# EasyEDA schematic SCH_Sensor IR - Trilho Ferrorama_2023-09-23 (1).json

## Sheets
1 Sheet_1: TITLE: Sheet_1; REV: 1.0; Date: 2023-09-11; Sheet: 1/1; Drawn By: thalesalves1; Company: Your Company
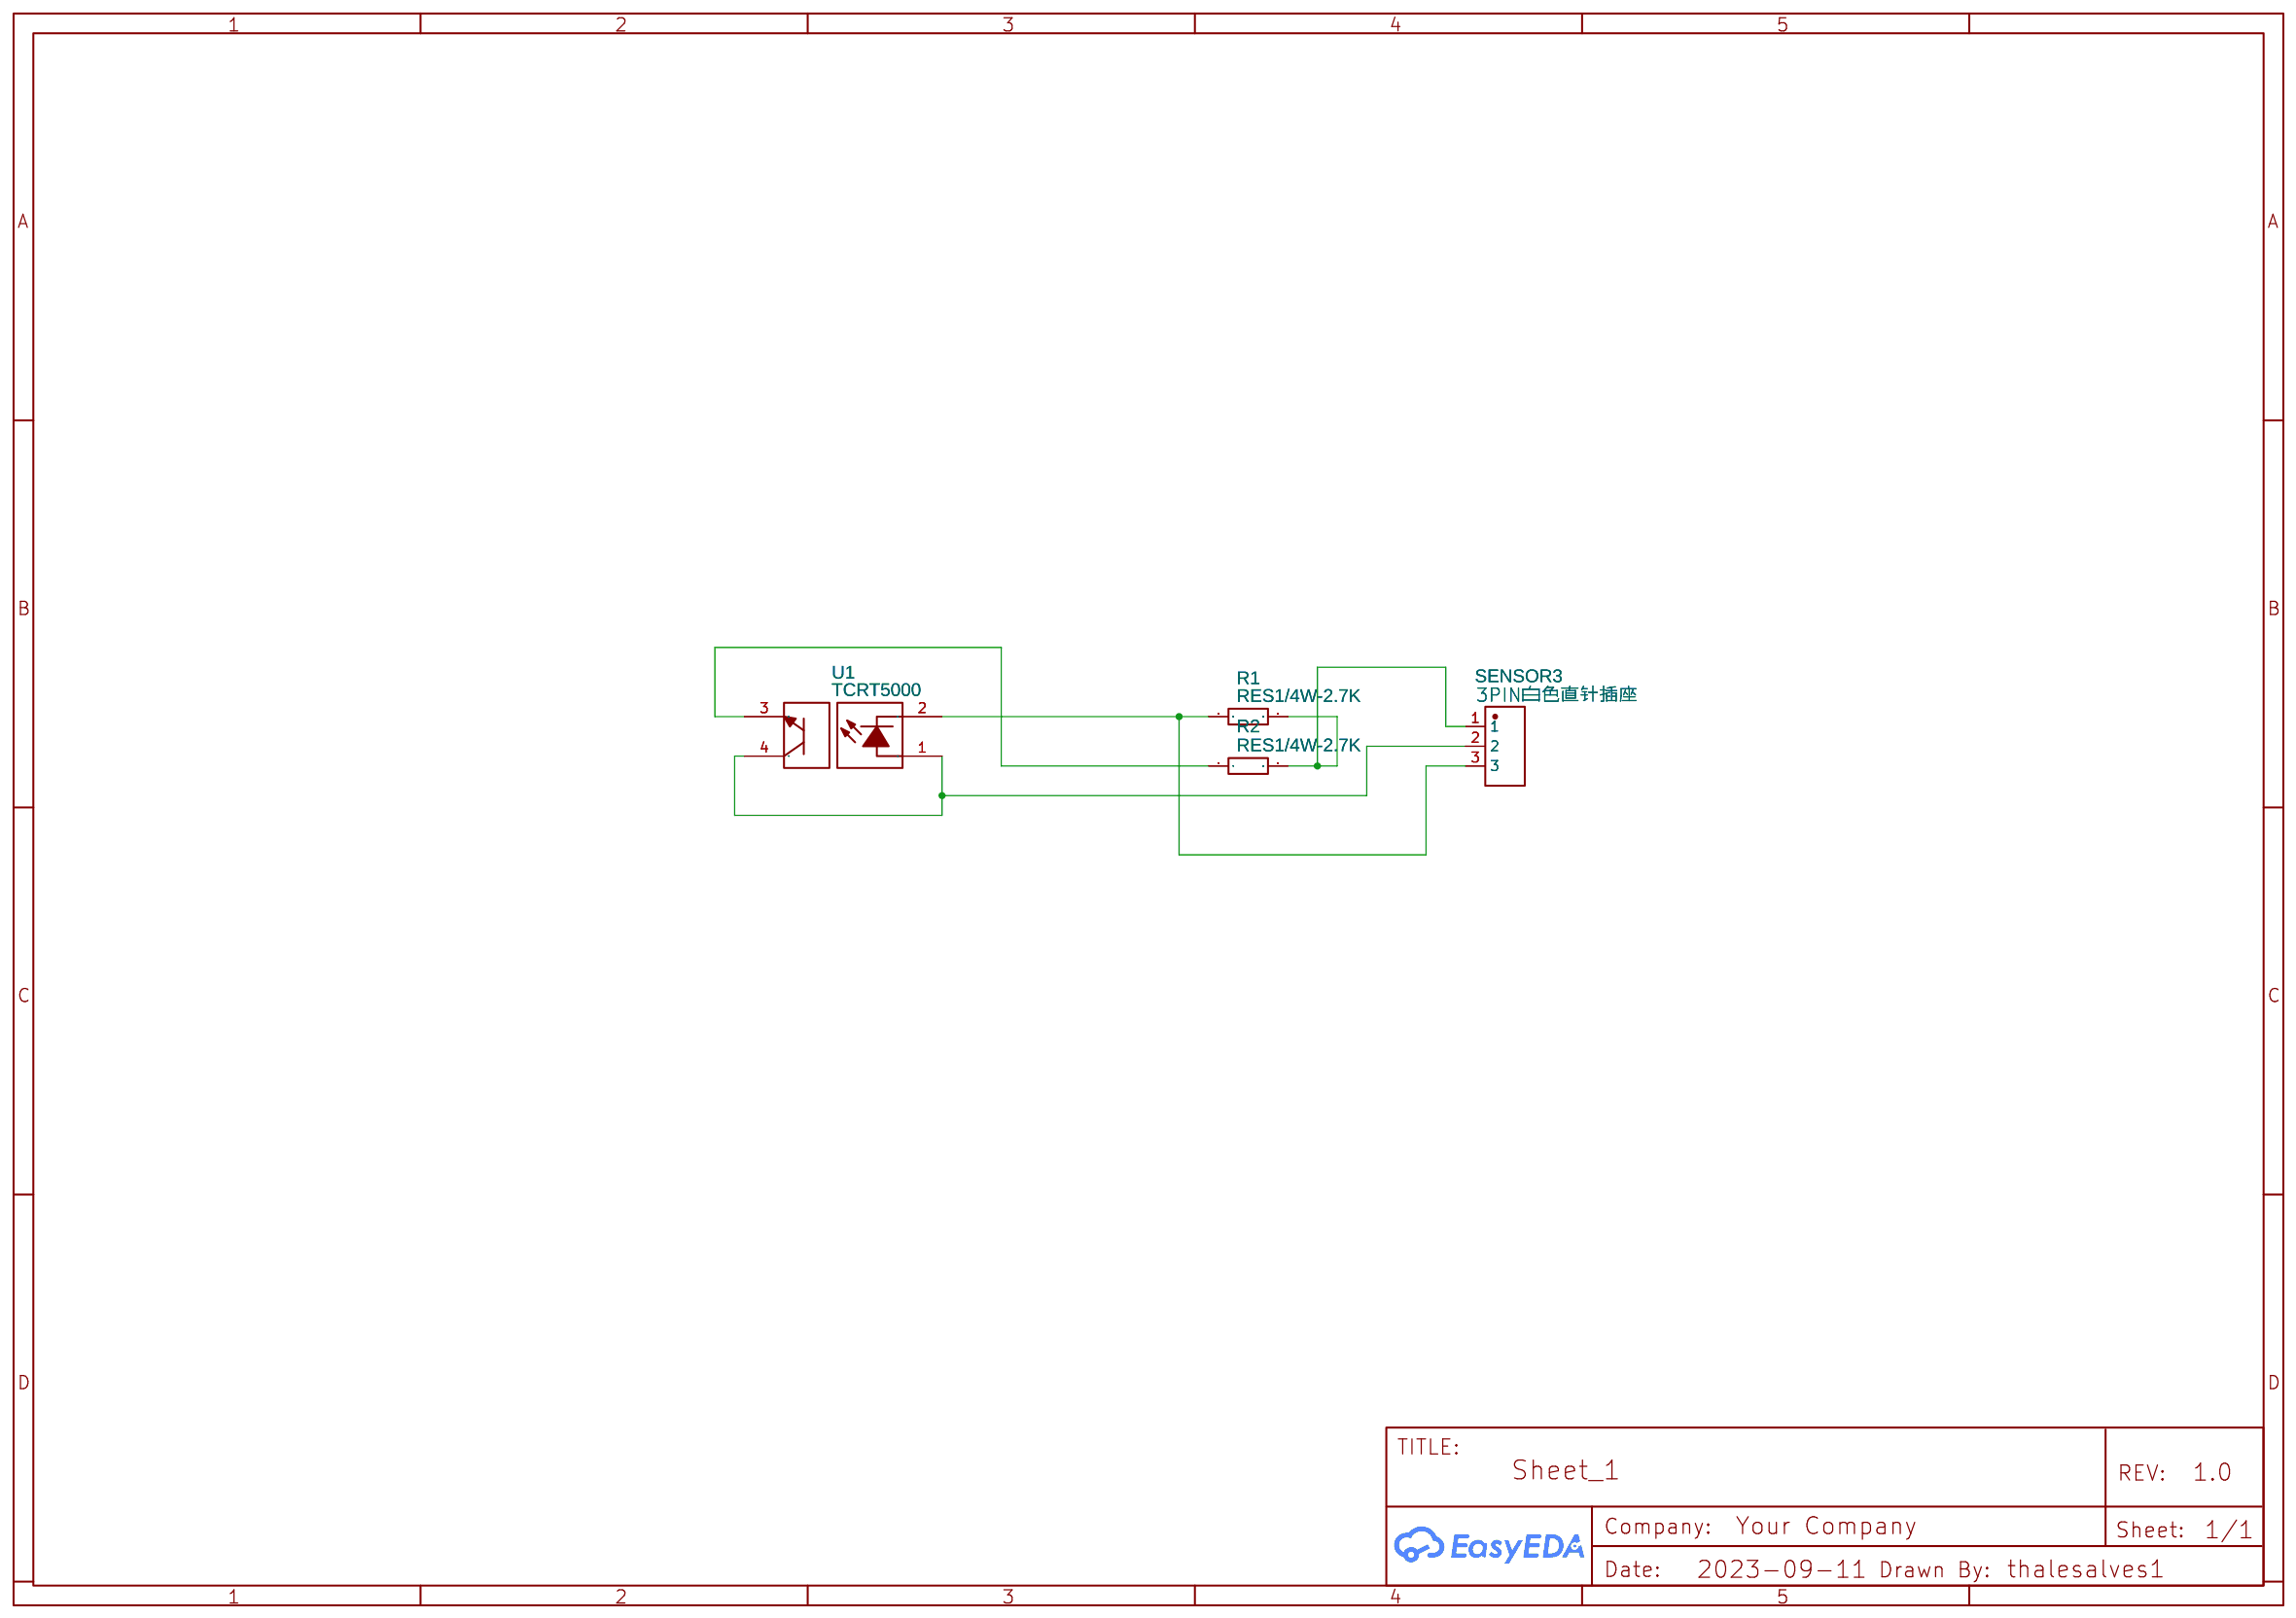
[diagram p0: Sheet_1]
2 Sheet_1#2
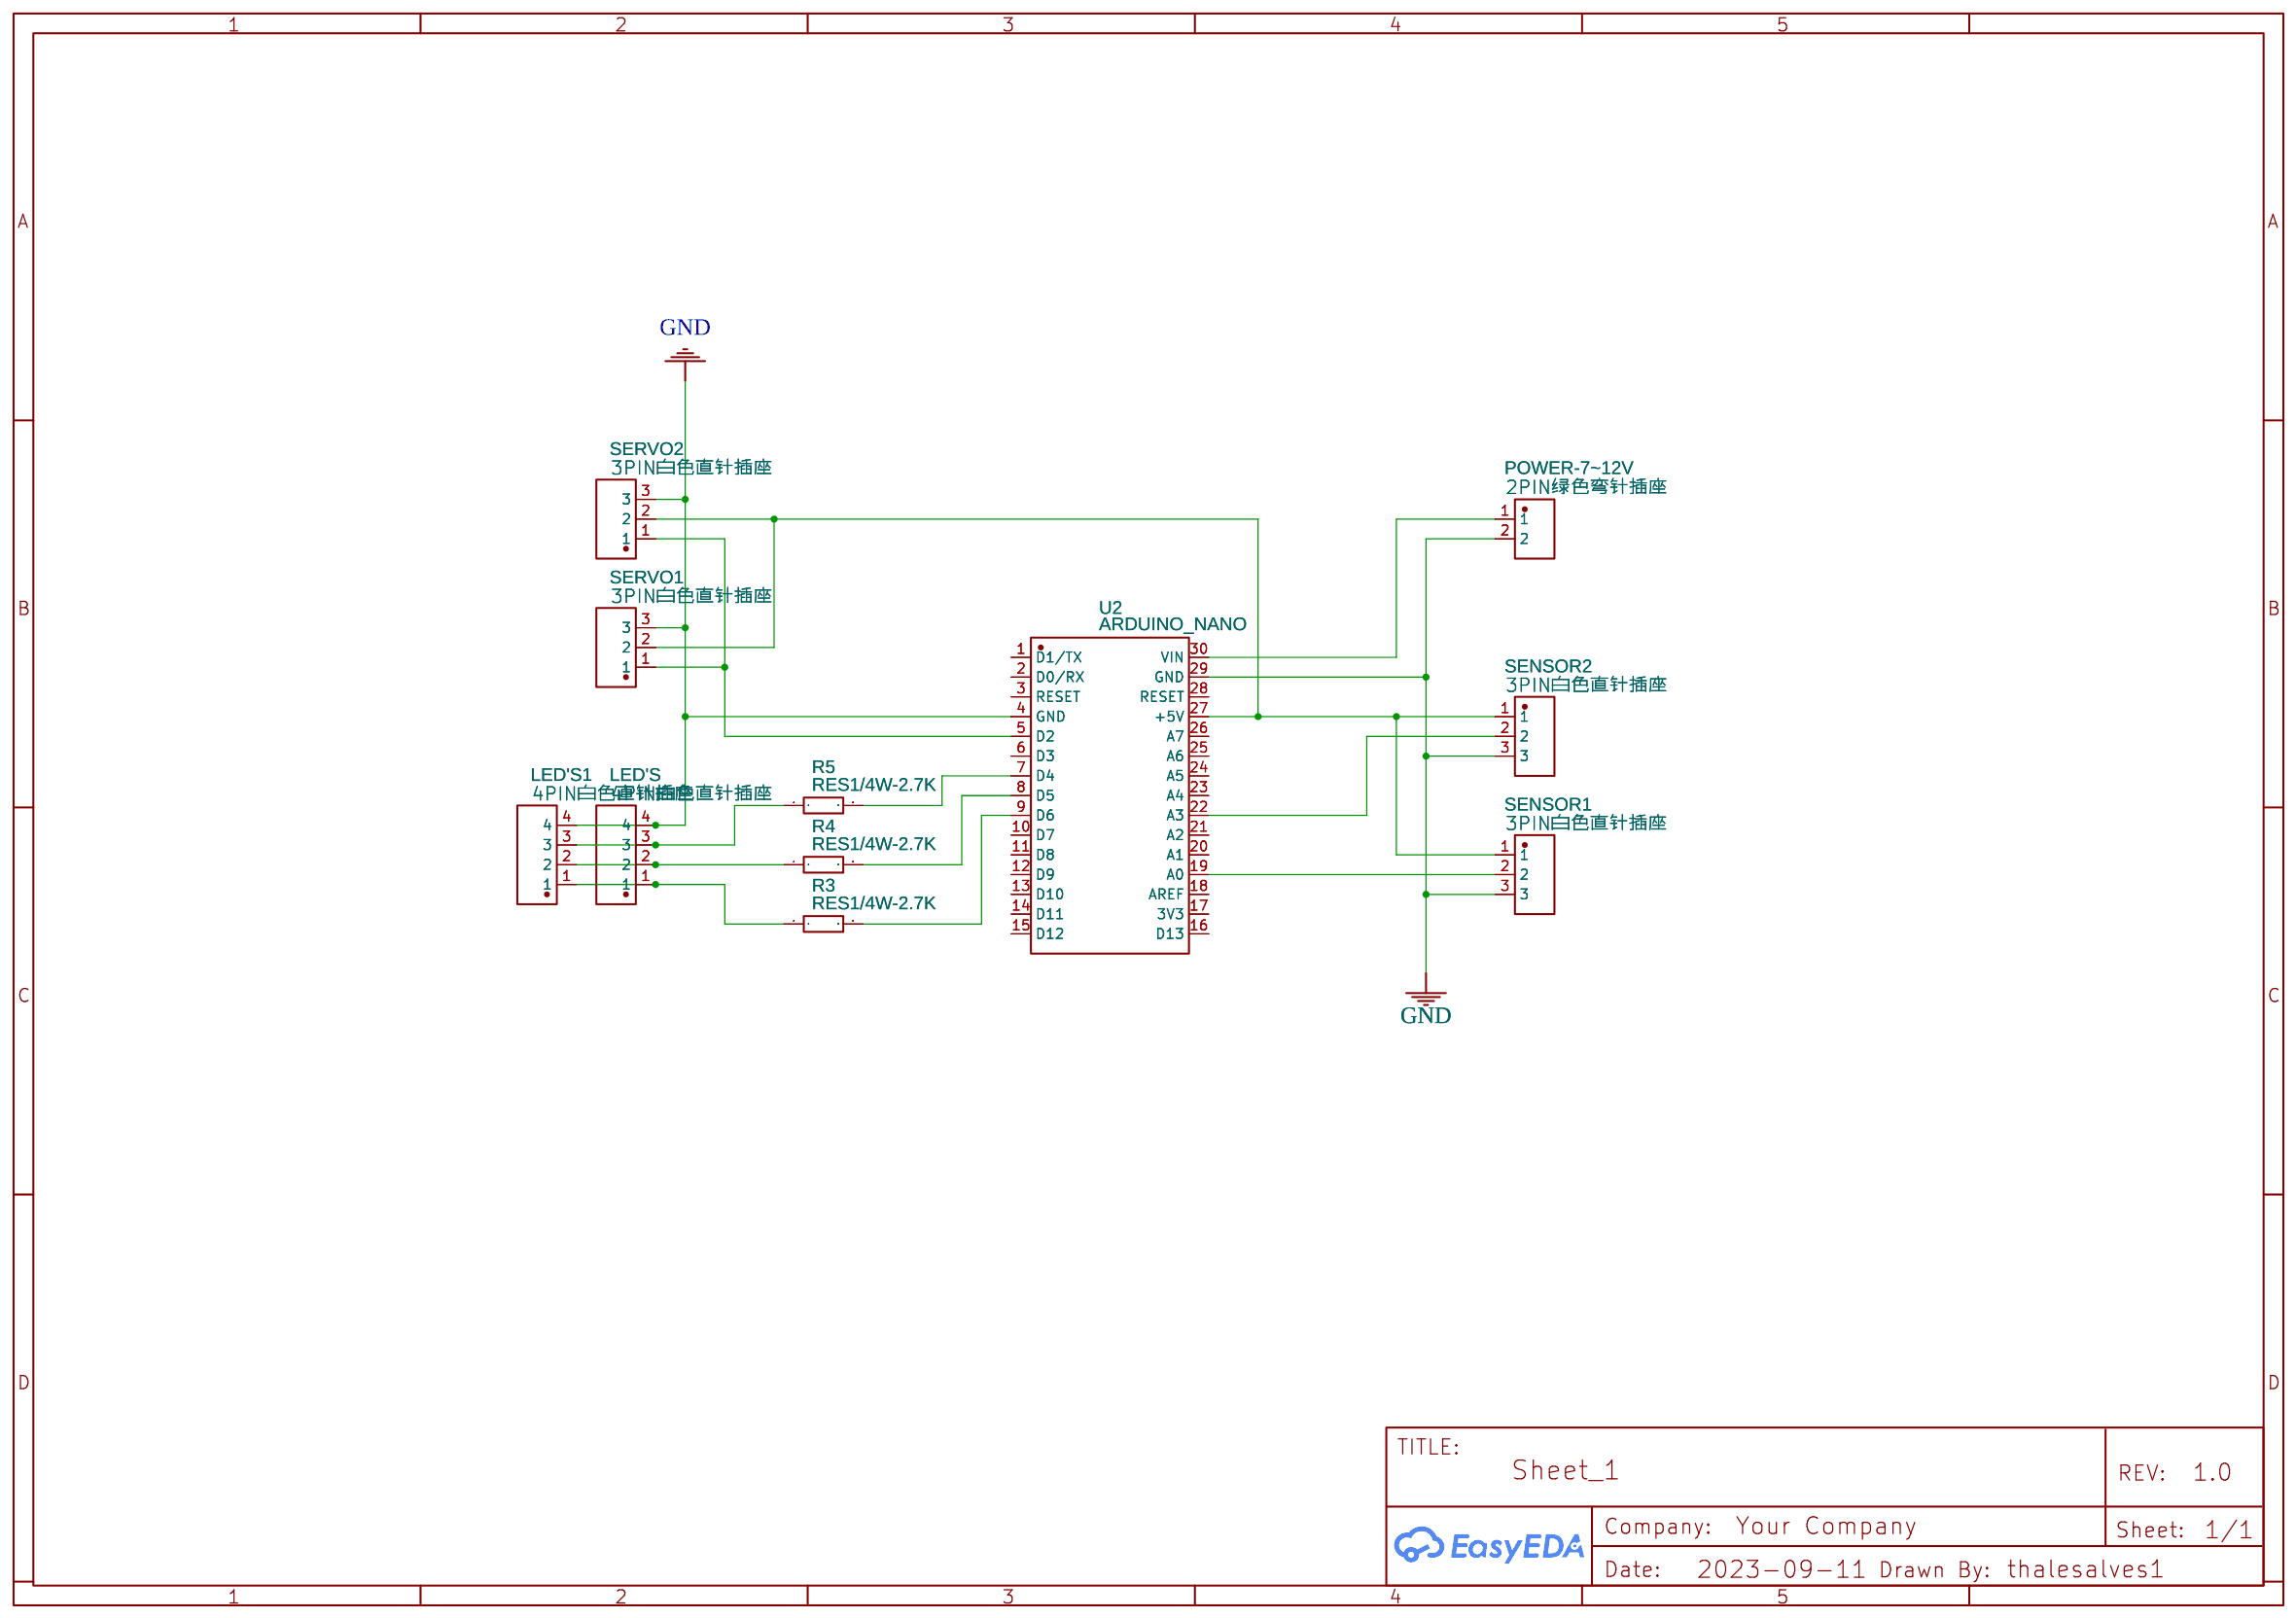
[diagram p1: Sheet_1#2]

## Parts
sheet Sheet_1#2
LED'S  4PIN白色直针插座  [CONN-TH_4P-P2.50_4PIN]
LED'S1  4PIN白色直针插座  [CONN-TH_4P-P2.50_4PIN]
POWER-7&#126;12V  2PIN绿色弯针插座  [CONN-TH_2P-P2.54_3-641213-2]
POWER-7~12V  2PIN绿色弯针插座
R3  RES1/4W-2.7K  [RES-TH_BD2.3-L6.5-P10.50-D0.5]
R4  RES1/4W-2.7K  [RES-TH_BD2.3-L6.5-P10.50-D0.5]
R5  RES1/4W-2.7K  [RES-TH_BD2.3-L6.5-P10.50-D0.5]
SENSOR1  3PIN白色直针插座  [CONN-TH_3P-P2.50_3PIN]
SENSOR2  3PIN白色直针插座  [CONN-TH_3P-P2.50_3PIN]
SERVO1  3PIN白色直针插座  [CONN-TH_3P-P2.50_3PIN]
SERVO2  3PIN白色直针插座  [CONN-TH_3P-P2.50_3PIN]
U2  ARDUINO_NANO  [COMM-TH_ARDUINO_NANO]
sheet Sheet_1
R1  RES1/4W-2.7K  [RES-TH_BD2.3-L6.5-P10.50-D0.5]
R2  RES1/4W-2.7K  [RES-TH_BD2.3-L6.5-P10.50-D0.5]
SENSOR3  3PIN白色直针插座  [CONN-TH_3P-P2.50_3PIN]
U1  TCRT5000  [OPTO-TH_TCRT5000]

## Library data of the parts
LED'S LED'S1 = 4PIN白色直针插座: Contributor: LCSC; Supplier: LCSC; Supplier Part: C9900004960; JLCPCB Part Class: Extended Part; Manufacturer: null; link: https://lcsc.com/eda_search?q=C9900004960&%26type=1&ref=editor
POWER-7&#126;12V = 2PIN绿色弯针插座: Contributor: LCSC; Supplier: LCSC; Supplier Part: C9900004959; JLCPCB Part Class: Extended Part; Manufacturer: null; link: https://lcsc.com/eda_search?q=C9900004959&%26type=1&ref=editor
POWER-7~12V = 2PIN绿色弯针插座: Manufacturer: null; Supplier Part: C9900004959; Supplier: LCSC; Datasheet: https://lcsc.com/eda_search?q=C9900004959&%26type=1&ref=editor
R1-R5 = RES1/4W-2.7K: Contributor: LCSC; Supplier: LCSC; Supplier Part: C9900002917; Manufacturer: null; JLCPCB Part Class: Extended Part; link: https://lcsc.com/eda_search?q=C9900002917&%26type=1&ref=editor
SENSOR1-SENSOR3 SERVO1 SERVO2 = 3PIN白色直针插座: Contributor: LCSC; Supplier: LCSC; Supplier Part: C9900004958; JLCPCB Part Class: Extended Part; Manufacturer: null; link: https://lcsc.com/eda_search?q=C9900004958&%26type=1&ref=editor
U2 = ARDUINO_NANO: Contributor: lcsc; Supplier: LCSC; Supplier Part: C9900017879; Manufacturer: null; JLCPCB Part Class: Extended Part; link: https://lcsc.com/eda_search?q=C9900017879&%26type=1&ref=editor
U1 = TCRT5000: Contributor: lcsc; Supplier: LCSC; Supplier Part: C2984661; Manufacturer: VISHAY(威世); JLCPCB Part Class: Extended Part; link: https://lcsc.com/eda_search?q=C2984661&%26type=1&ref=editor

## Nets
GND: LED'S.4 LED'S1.4 POWER-7&#126;12V.2 SENSOR1.3 SENSOR2.3 SERVO1.3 SERVO2.3 U2.4(GND) U2.29(GND)
Net-(LED'S-1): LED'S.1 LED'S1.1 R3.1
Net-(LED'S-2): LED'S.2 LED'S1.2 R4.1
Net-(LED'S-3): LED'S.3 LED'S1.3 R5.1
Net-(POWER-7&#126;12V-1): POWER-7&#126;12V.1 U2.30(VIN)
Net-(R1-1): R1.1 SENSOR3.3 U1.2
Net-(R1-2): R1.2 R2.2 SENSOR3.1
Net-(R2-1): R2.1 U1.3
Net-(R3-2): R3.2 U2.9(D6)
Net-(R4-2): R4.2 U2.8(D5)
Net-(R5-2): R5.2 U2.7(D4)
Net-(SENSOR1-1): SENSOR1.1 SENSOR2.1 SERVO1.2 SERVO2.2 U2.27(+5V)
Net-(SENSOR1-2): SENSOR1.2 U2.19(A0)
Net-(SENSOR2-2): SENSOR2.2 U2.22(A3)
Net-(SENSOR3-2): SENSOR3.2 U1.1 U1.4
Net-(SERVO1-1): SERVO1.1 SERVO2.1 U2.5(D2)

Not connected (* = marked no-connect by the designer): U2 1(D1/TX) 2(D0/RX) 3(RESET) 6(D3) 10(D7) 11(D8) 12(D9) 13(D10) 14(D11) 15(D12) 16(D13) 17(3V3) 18(AREF) 20(A1) 21(A2) 23(A4) 24(A5) 25(A6) 26(A7) 28(RESET)
